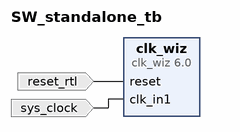
[diagram p0: block diagram of the top level]
# Vivado block design SW_standalone_tb, xc7z020clg484-1, Vivado 2024.1
create_bd_design SW_standalone_tb

create_bd_port -dir I -type clk sys_clock
set_property -dict {CONFIG.FREQ_HZ 100000000 CONFIG.PHASE 0.0} [get_bd_ports sys_clock]
create_bd_port -dir I -type rst reset_rtl
set_property -dict {CONFIG.POLARITY ACTIVE_HIGH} [get_bd_ports reset_rtl]

create_bd_cell -type ip -vlnv xilinx.com:ip:clk_wiz:6.0 clk_wiz
set_property -dict [list \
  CONFIG.CLKIN2_JITTER_PS 166.66 \
  CONFIG.CLKOUT1_JITTER 137.143 \
  CONFIG.CLKOUT1_REQUESTED_OUT_FREQ 80 \
  CONFIG.CLK_IN1_BOARD_INTERFACE sys_clock \
  CONFIG.CLK_IN2_BOARD_INTERFACE Custom \
  CONFIG.MMCM_CLKIN2_PERIOD 10.000 \
  CONFIG.MMCM_CLKOUT0_DIVIDE_F 12.500 \
  CONFIG.SECONDARY_SOURCE Single_ended_clock_capable_pin \
  CONFIG.USE_BOARD_FLOW true \
  CONFIG.USE_INCLK_SWITCHOVER false \
] [get_bd_cells clk_wiz]

# ---- connections ----

connect_bd_net [get_bd_ports reset_rtl] [get_bd_pins clk_wiz/reset]
connect_bd_net [get_bd_ports sys_clock] [get_bd_pins clk_wiz/clk_in1]

validate_bd_design
save_bd_design
